# Altium schematic sheet AUX_OPAMP.SchDoc
size A4; SheetNumber: 4; SheetTotal: 15
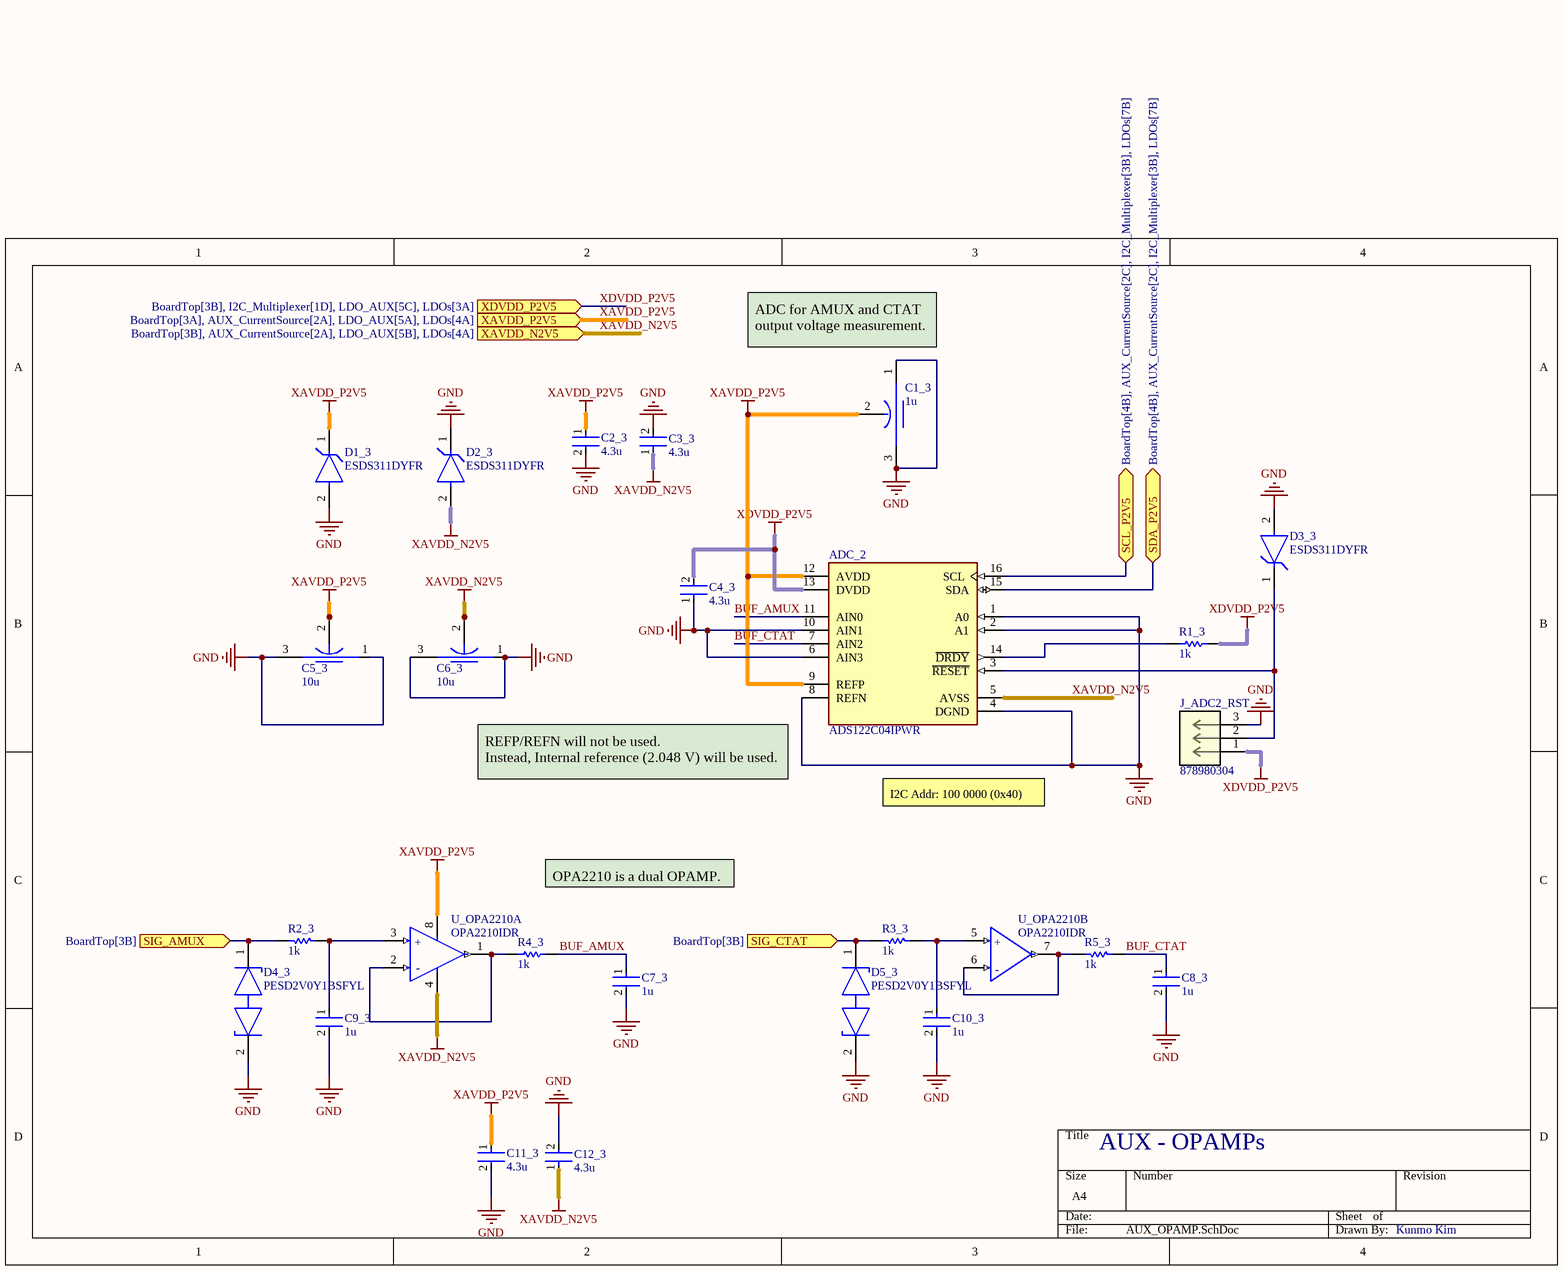
[diagram p0: AUX_OPAMP.SchDoc]

## Parts
ADC_2  ADS122C04IPWR  [FP-PW0016A-IPC_C]
C1_3  1u  [PCBComponent_1]
C2_3  4.3u  [FP-LLL1U4-0_05-MFG]
C3_3  4.3u  [FP-LLL1U4-0_05-MFG]
C4_3  4.3u  [FP-LLL1U4-0_05-MFG]
C5_3  10u  [FP-NFM15-0_2-MFG]
C6_3  10u  [FP-NFM15-0_2-MFG]
C7_3  1u  [FP-C0402C105K8PACTU-IPC_A]
C8_3  1u  [FP-C0402C105K8PACTU-IPC_A]
C9_3  1u  [FP-C0402C105K8PACTU-IPC_A]
C10_3  1u  [FP-C0402C105K8PACTU-IPC_A]
C11_3  4.3u  [FP-LLL1U4-0_05-MFG]
C12_3  4.3u  [FP-LLL1U4-0_05-MFG]
D1_3  ESDS311DYFR  [FP-DYF0002A-IPC_B]
D2_3  ESDS311DYFR  [FP-DYF0002A-IPC_B]
D3_3  ESDS311DYFR  [FP-DYF0002A-IPC_B]
D4_3  PESD2V0Y1BSFYL  [FP-SOD962-2-MFG]
D5_3  PESD2V0Y1BSFYL  [FP-SOD962-2-MFG]
J_ADC2_RST  878980304  [CONN03_87898_M-5p84_MOL]
R1_3  1k  [RESC1608X55X30LL15T15]
R2_3  1k  [RESC1608X55X30LL15T15]
R3_3  1k  [RESC1608X55X30LL15T15]
R4_3  1k  [RESC1608X55X30LL15T15]
R5_3  1k  [RESC1608X55X30LL15T15]
U_OPA2210  OPA2210IDR  [FP-D0008A-MFG]  (parts A,B of 2)

## Ports
SCL_P2V5 (bidir, see BoardTop[4B], AUX_CurrentSource[2C], I2C_Multiplexer[3B], LDOs[7B]), SDA_P2V5 (bidir, see BoardTop[4B], AUX_CurrentSource[2C], I2C_Multiplexer[3B], LDOs[7B]), SIG_AMUX (in, see BoardTop[3B]), SIG_CTAT (in, see BoardTop[3B]), XAVDD_N2V5 (in, see BoardTop[3B], AUX_CurrentSource[2A], LDO_AUX[5B], LDOs[4A]), XAVDD_P2V5 (in, see BoardTop[3A], AUX_CurrentSource[2A], LDO_AUX[5A], LDOs[4A]), XDVDD_P2V5 (in, see BoardTop[3B], I2C_Multiplexer[1D], LDO_AUX[5C], LDOs[3A])

## Nets
GND: ADC_2.1(A0) ADC_2.2(A1) ADC_2.4(DGND) ADC_2.6(AIN3) ADC_2.8(REFN) ADC_2.10(AIN1) C1_3.1(Input) C1_3.3(Output) C2_3.2 C3_3.2 C4_3.1 C5_3.1(Input) C5_3.3(Output) C6_3.1(Input) C6_3.3(Output) C7_3.2 C8_3.2 C9_3.2 C10_3.2 C11_3.2 C12_3.2 D1_3.2(GND) D2_3.1(I/O) D3_3.2(GND) D4_3.2(K2) D5_3.2(K2) J_ADC2_RST.3
XAVDD_N2V5: ADC_2.5(AVSS) C3_3.1 C6_3.2(GND) C12_3.1 D2_3.2(GND) U_OPA2210.4(V-) ; port XAVDD_N2V5
XAVDD_P2V5: ADC_2.9(REFP) ADC_2.12(AVDD) C1_3.2(GND) C2_3.1 C5_3.2(GND) C11_3.1 D1_3.1(I/O) U_OPA2210.8(V+) ; port XAVDD_P2V5
XDVDD_P2V5: ADC_2.13(DVDD) C4_3.2 J_ADC2_RST.1 R1_3.1 ; port XDVDD_P2V5
BUF_AMUX: ADC_2.11(AIN0) C7_3.1 R4_3.1
BUF_CTAT: ADC_2.7(AIN2) C8_3.1 R5_3.2
SCL_P2V5: ADC_2.16(SCL) ; port SCL_P2V5
SDA_P2V5: ADC_2.15(SDA) ; port SDA_P2V5
SIG_AMUX: D4_3.1(K1) R2_3.1 ; port SIG_AMUX
SIG_CTAT: D5_3.1(K1) R3_3.1 ; port SIG_CTAT
NetADC_2_3: ADC_2.3(~{RESET}) D3_3.1(I/O) J_ADC2_RST.2
NetADC_2_14: ADC_2.14(~{DRDY}) R1_3.2
NetC9_3_1: C9_3.1 R2_3.2 U_OPA2210.3(+IN_A)
NetC10_3_1: C10_3.1 R3_3.2 U_OPA2210.5(+IN_B)
NetR4_3_2: R4_3.2 U_OPA2210.1(OUT_A) U_OPA2210.2(-IN_A)
NetR5_3_1: R5_3.1 U_OPA2210.6(-IN_B) U_OPA2210.7(OUT_B)

## Notes on the sheet
- (near C1_3) ADC for AMUX and CTAT
  output voltage measurement.
- REFP/REFN will not be used.
  Instead, Internal reference (2.048 V) will be used.
- I2C Addr: 100 0000 (0x40)
- OPA2210 is a dual OPAMP.
- AUX - OPAMPs
- Kunmo Kim
- (in symbol CMP-04895-000036-1, part A) +; -
- (in symbol CMP-04895-000036-1, part B) +; -

## Library data of the parts
ADC_2 = CMP-04860-000041-1: IC ADC 24BIT SIGMA-DELTA 16TSSOP; Sampling Rate: 2000S/s; Number of Bits: 24; Number of A/D Converters: 1; Number of Inputs: 4; Interface: I2C; Packaging: Tape and Reel; Case/Package: TSSOP; Mount: Surface Mount; RoHS Compliant: Yes; Max Operating Temperature: 125°C; Number of Pins: 16; Min Operating Temperature: -40°C
C1_3 = CMP-06053-000757-1: 0402(1005M) 4V 1.0UF +/- 20% 3 T; Capacitance: 1uF; Current: 2A; Case/Package: 0402; Max Operating Temperature: 125°C; Min Operating Temperature: -55°C; Mount: Surface Mount; Ratings: AEC-Q200; Series: EMIFIL®, NFM15; Tolerance: 20%; Voltage Rating: 4V; Supplier 1: Mouser; Supplier Part Number 1: 81-NFM15HC105D0G3D
C2_3 C3_3 C4_3 C11_3 C12_3 = CMP-06035-061933-1: Cap Ceramic Monolithic 4.3uF 20% 4V X5R 15% 02404 (0610M); Capacitance: 4.3uF; Tolerance: 20%; Min Operating Temperature: -55°C; Case/Package: 0204; Voltage Rating: 4V; Mount: Surface Mount; Max Operating Temperature: 85°C; Packaging: Tape and Reel; RoHS Compliant: Yes
C5_3 C6_3 = CMP-06053-000058-1: CAP FEEDTHRU
C7_3 C8_3 C9_3 C10_3 = CMP-2008-02081-2: CAP CER 1UF 10V X5R 0402; Dielectric Material: Ceramic; Dissipation Factor: 5%; Tolerance: 10%; Number of Pins: 2; Contact Plating: Tin; Min Operating Temperature: -55°C; Termination: SMD/SMT; Lead Free: Lead Free; Construction: Flat; Voltage Rating (DC): 10V; Mount: Surface Mount; Series: C; Thickness: 0.022inch; Width: 0.5mm; Radiation Hardening: No; Capacitance: 1uF; Dielectric: X5R; Height: 0.5mm; Voltage: 10V; Length: 1mm; Depth: 0.5mm; Max Operating Temperature: 85°C; Package Quantity: 1; Packaging: Tape and Reel; RoHS Compliant: Yes; Case Code (Imperial): 0402; Case Code (Metric): 1005; REACH SVHC: No SVHC; Voltage Rating: 10V; Case/Package: 0402; Supplier 1: Mouser; Supplier Part Number 1: 80-C0402C105K8P
D1_3 D2_3 D3_3 = CMP-00370-147271020-1: ESDS311DYFR One-channel unidirectional device for 3.3V surge protection in SOD-323 package 2-SOT -40 to 125; Manufacturer Lifecycle Status: ACTIVE; Number of Pins: 2; Width: 1.7mm; Length: 1.3mm; NexarPartId: 147271020; Height: 0m; Case/Package: SOT; Thickness: 850µm; Lifecycle Status: Production
D4_3 D5_3 = CMP-14436-000022-1: TVS DIODE 2VWM 3VC DSN0603-2
J_ADC2_RST = 878980304: No Description Available; Mfr_Name: Molex Connector Corporation; RefDes: RefDes; Type: Type
R1_3 R2_3 R3_3 R4_3 R5_3 = CMP-2000-00180-1: Part Number: ERJ-3EKF1001V; Manufacturer: Panasonic; Supplier 1: Mouser; Supplier Part Number 1: 667-ERJ-3EKF1001V
U_OPA2210 = CMP-04895-000036-1: IC OP-AMP; Manufacturer: Texas Instruments; Max Dual Supply Voltage: 18V; Nominal Supply Current: 2.2mA; Standoff Height: 0.11mm; Number Of Channels: 2; Max Supply Voltage: 36V; Min Supply Voltage: 4.5V; Max Junction Temp: +150°C; Input Bias Current: 0.0003uA; Min Dual Supply Voltage: 2.25V; Gain Bandwidth: 18MHz; Output Current Per Channel: 65mA; Octopart: https://octopart.com/opa2210idr-texas+instruments-105815795; Temperature Range Low: -55°C; ComponentLink2URL: https://www.ti.com/lit/ds/symlink/opa2210.pdf; Package: D0008A; Ambient Temperature Range Low: -55°C; Manufacturer Part Number: OPA2210IDR; Automotive: No; Temperature Range High: +150°C; Height: 1.75mm; Ambient Temperature Range High: +150°C; ComponentLink2Description: Datasheet; Device Class L2: Linear ICs; Category: IC; Device Class L1: Integrated Circuits (ICs); Digikey Description: IC OP-AMP; Device Class L3: Amplifiers - Op Amps; RoHS: TRUE; Temperature: -55°C to +150°C; Lead Free: Yes